# EAGLE design beaconboard3 (EAGLE 6.6.0)
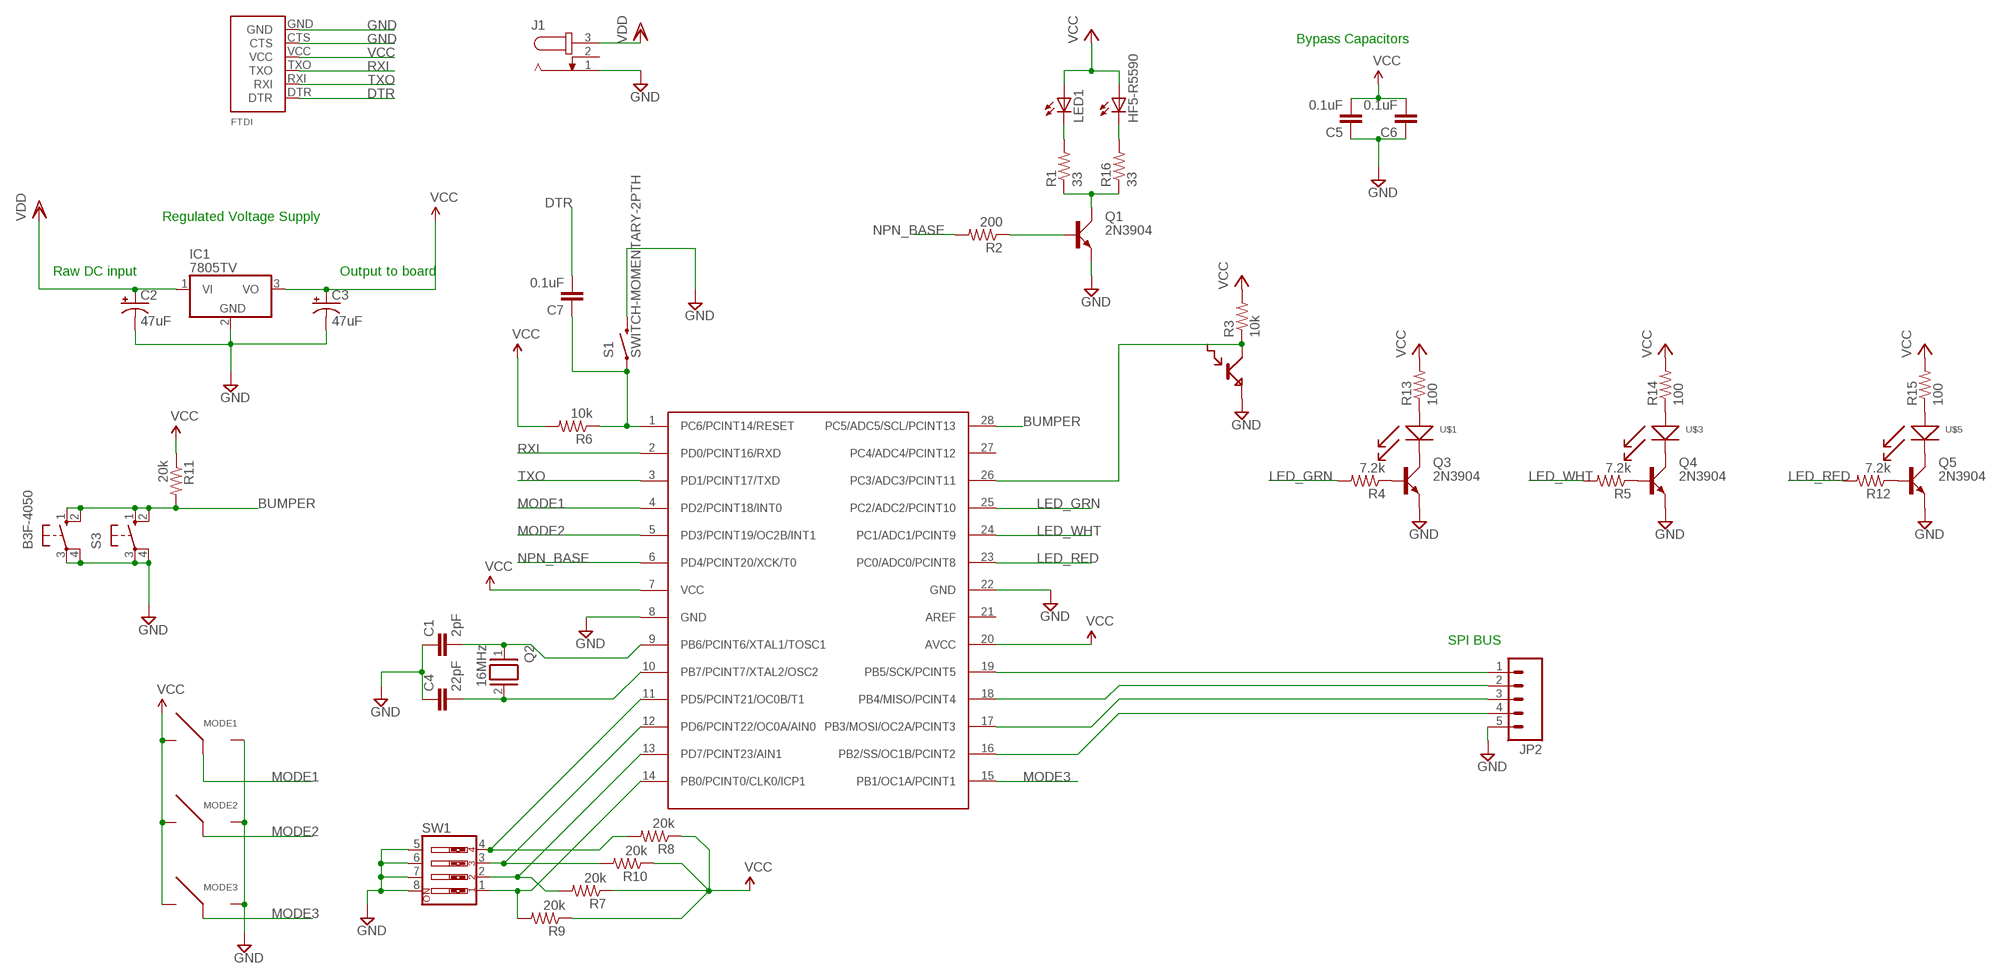
[diagram p0: schematic, sheet 1]

## Parts
B3F-4050  40-XX  [B3F-40XX]
C1  2pF  CAPPTH  [CAP-PTH-SMALL]
C2  47uF  CAP_POLPTH2  [CPOL-RADIAL-10UF-25V]
C3  47uF  CAP_POLPTH2  [CPOL-RADIAL-10UF-25V]
C4  22pF  CAPPTH  [CAP-PTH-SMALL]
C5  0.1uF  CAPPTH1  [CAP-PTH-5MM]
C6  0.1uF  CAPPTH1  [CAP-PTH-5MM]
C7  0.1uF  CAPPTH1  [CAP-PTH-5MM]
HF5-R5590  LED-2AC-CP41B-WES  [CP41B]
IC1  7805TV  [TO220V]
J1  JACK-PLUG1  [SPC4078]
JP2  M05LOCK_LONGPADS  [1X05_LOCK_LONGPADS]
LED1  LED-2AC-CP41B-WES  [CP41B]
MODE1  SPD_SLIDE_SWITCH  [SPDT_SLIDE_SWITCH]
MODE2  SPD_SLIDE_SWITCH  [SPDT_SLIDE_SWITCH]
MODE3  SPD_SLIDE_SWITCH  [SPDT_SLIDE_SWITCH]
Q1  2N3904  [TO92D]
Q2  16MHz  XTAL/S  [QS]
Q3  2N3904  [TO92D]
Q4  2N3904  [TO92D]
Q5  2N3904  [TO92D]
R1  33  RESISTORPTH-1/4W  [AXIAL-0.4]
R2  200  RESISTORPTH-1/4W  [AXIAL-0.4]
R3  10k  RESISTORPTH-1/4W  [AXIAL-0.4]
R4  7.2k  RESISTORPTH-1/4W  [AXIAL-0.4]
R5  7.2k  RESISTORPTH-1/4W  [AXIAL-0.4]
R6  10k  RESISTORPTH-1/4W  [AXIAL-0.4]
R7  20k  RESISTORPTH-1/4W  [AXIAL-0.4]
R8  20k  RESISTORPTH-1/4W  [AXIAL-0.4]
R9  20k  RESISTORPTH-1/4W  [AXIAL-0.4]
R10  20k  RESISTORPTH-1/4W  [AXIAL-0.4]
R11  20k  RESISTORPTH-1/4W  [AXIAL-0.4]
R12  7.2k  RESISTORPTH-1/4W  [AXIAL-0.4]
R13  100  RESISTORPTH-1/4W  [AXIAL-0.4]
R14  100  RESISTORPTH-1/4W  [AXIAL-0.4]
R15  100  RESISTORPTH-1/4W  [AXIAL-0.4]
R16  33  RESISTORPTH-1/4W  [AXIAL-0.4]
S1  SWITCH-MOMENTARY-2PTH  [TACTILE-PTH]
S3  40-XX  [B3F-40XX]
SW1  SW_DIP-4  [EDG-04]
U$1  8MM_LED  [8MM_LED]
U$2  BPW77NA  [TO-18]
U$3  8MM_LED  [8MM_LED]
U$4  ATMEGA328  [DIL28-3]
U$5  8MM_LED  [8MM_LED]
U$6  FTDI  [FTDI]

## Nets
BUMPER: B3F-4050.1(S) B3F-4050.2(S1) R11.P$2 S3.1(S) S3.2(S1) U$4.28(PC5/ADC5/SCL/PCINT13)
DTR: C7.2 U$6.DTR
GND: B3F-4050.3(P) B3F-4050.4(P1) C1.1 C2.2(-) C3.2(-) C4.1 C5.1 C6.1 IC1.2(GND) J1.1 JP2.5 MODE1.3 MODE2.3 MODE3.3 Q1.E Q3.E Q4.E Q5.E S1.3 S3.3(P) S3.4(P1) SW1.5 SW1.6 SW1.7 SW1.8 U$2.E U$4.8(GND) U$4.22(GND) U$6.CTS U$6.GND
LED_GRN: R4.P$2 U$4.25(PC2/ADC2/PCINT10)
LED_RED: R12.P$2 U$4.23(PC0/ADC0/PCINT8)
LED_WHT: R5.P$2 U$4.24(PC1/ADC1/PCINT9)
MODE1: MODE1.2 U$4.4(PD2/PCINT18/INT0)
MODE2: MODE2.2 U$4.5(PD3/PCINT19/OC2B/INT1)
MODE3: MODE3.2 U$4.15(PB1/OC1A/PCINT1)
N$1: Q1.C R1.P$1 R16.P$1
N$2: Q1.B R2.P$1
N$3: LED1.1(C) LED1.4(C) R1.P$2
N$4: Q3.B R4.P$1
N$5: JP2.1 U$4.19(PB5/SCK/PCINT5)
N$6: JP2.2 U$4.18(PB4/MISO/PCINT4)
N$7: JP2.3 U$4.17(PB3/MOSI/OC2A/PCINT3)
N$8: Q4.B R5.P$1
N$9: R3.P$1 U$2.C U$4.26(PC3/ADC3/PCINT11)
N$10: Q5.B R12.P$1
N$11: C7.1 R6.P$1 S1.1 U$4.1(PC6/PCINT14/RESET)
N$12: C1.2 Q2.1 U$4.9(PB6/PCINT6/XTAL1/TOSC1)
N$13: C4.2 Q2.2 U$4.10(PB7/PCINT7/XTAL2/OSC2)
N$14: R7.P$2 SW1.2 U$4.13(PD7/PCINT23/AIN1)
N$15: R8.P$2 SW1.4 U$4.11(PD5/PCINT21/OC0B/T1)
N$16: R10.P$2 SW1.3 U$4.12(PD6/PCINT22/OC0A/AIN0)
N$17: Q3.C U$1.NEG
N$18: Q4.C U$3.NEG
N$19: R9.P$2 SW1.1 U$4.14(PB0/PCINT0/CLK0/ICP1)
N$20: JP2.4 U$4.16(PB2/SS/OC1B/PCINT2)
N$21: Q5.C U$5.NEG
N$22: R13.P$1 U$1.POS
N$23: R14.P$1 U$3.POS
N$24: R15.P$1 U$5.POS
N$25: HF5-R5590.1(C) HF5-R5590.4(C) R16.P$2
NPN_BASE: R2.P$2 U$4.6(PD4/PCINT20/XCK/T0)
RXI: U$4.2(PD0/PCINT16/RXD) U$6.TXO
TXO: U$4.3(PD1/PCINT17/TXD) U$6.RXI
VCC: C3.1(+) C5.2 C6.2 HF5-R5590.2(A) HF5-R5590.3(A) IC1.3(VO) LED1.2(A) LED1.3(A) MODE1.1 MODE2.1 MODE3.1 R3.P$2 R6.P$2 R7.P$1 R8.P$1 R9.P$1 R10.P$1 R11.P$1 R13.P$2 R14.P$2 R15.P$2 U$4.7(VCC) U$4.20(AVCC) U$6.VCC
VDD: C2.1(+) IC1.1(VI) J1.3
Unconnected: J1.2 U$4.21(AREF) U$4.27(PC4/ADC4/PCINT12)

## Notes on the sheet
- Bypass Capacitors
- Regulated Voltage Supply
- Raw DC input | Output to board
- SPI BUS

## Library data of the parts
B3F-4050 S3 = switch-omron:40-XX: OMRON SWITCH; MF: OMRON COMPONENTS USA; MPN: B3F-4000; OC_FARNELL: 176434; OC_NEWARK: 36K3105
C1 C4-C7 = SparkFun-Passives:CAP: Capacitor Standard 0603 ceramic capacitor, and 0.1" leaded capacitor.
C2 C3 = SparkFun-Capacitors:CAP_POL: Capacitor Polarized These are standard SMD and PTH capacitors. Normally 10uF, 47uF, and 100uF in electrolytic and tantalum varieties. Always verify the external diameter of the through hole cap, it varies with capacity, voltage, and manufacturer. The EIA devices should be standard.
HF5-R5590 LED1 = led:LED-2AC-: LEDs with 2 Cathode & 2 Anode - Kingbright SUPER FLUX LED LAMP Source: www.us.kingbright.com/images/catalog/SPEC/W7676CPBC-H.pdf Cree® P4 LED CP41B-WES/WGS Source: Data sheet <http://www.cree.com/products/pdf/LEDlamps/CP41B-WES&WGS.pdf>
IC1 = linear:78*: Positive VOLTAGE REGULATOR Source: http://cache.national.com/ds/LM/LM78L05.pdf http://www.fairchildsemi.com/ds/LM/LM7805.pdf
J1 = con-jack:JACK-PLUG: DC POWER JACK Power Jack, DC, Right Angle, Through Hole, Rated 5A at 16VDC, PC Terminals Distributor: Farnell (www.Farnell.de) Drawing: 84N1161.pdf / 84N1162.pdf Manufacturer: SPC Technology (www.spctechnology.com) Type: SPC4077 / SPC 4078; OC_FARNELL: unknown; OC_NEWARK: unknown
JP2 = SparkFun-Connectors:M05: Header 5 Standard 5-pin 0.1" header. Use with straight break away headers (SKU : PRT-00116), right angle break away headers (PRT-00553), swiss pins (PRT-00743), machine pins (PRT-00117), and female headers (PRT-00115). Molex polarized connector foot print use with SKU : PRT-08230 with associated crimp pins and housings.
MODE1-MODE3 = e11:SPD_SLIDE_SWITCH
Q1 Q3-Q5 = transistor-small-signal:2N3904: NPN TRANSISTOR
Q2 = special:XTAL/S: CRYSTAL
R1-R16 = SparkFun-Resistors:RESISTOR: Resistor Basic schematic elements and footprints for 0603, 1206, and PTH resistors.
S1 = SparkFun-Electromechanical:SWITCH-MOMENTARY-2: Various NO switches- pushbuttons, reed, etc
SW1 = special:SW_DIP-4: DIP SWITCH
U$1 U$3 U$5 = e11:8MM_LED
U$2 = e11:BPW77NA
U$4 = hmcfabstudio:ATMEGA328: Atmega328 in a DIL28 package with pin names taken from the datasheet.
U$6 = e11:FTDI

## Board
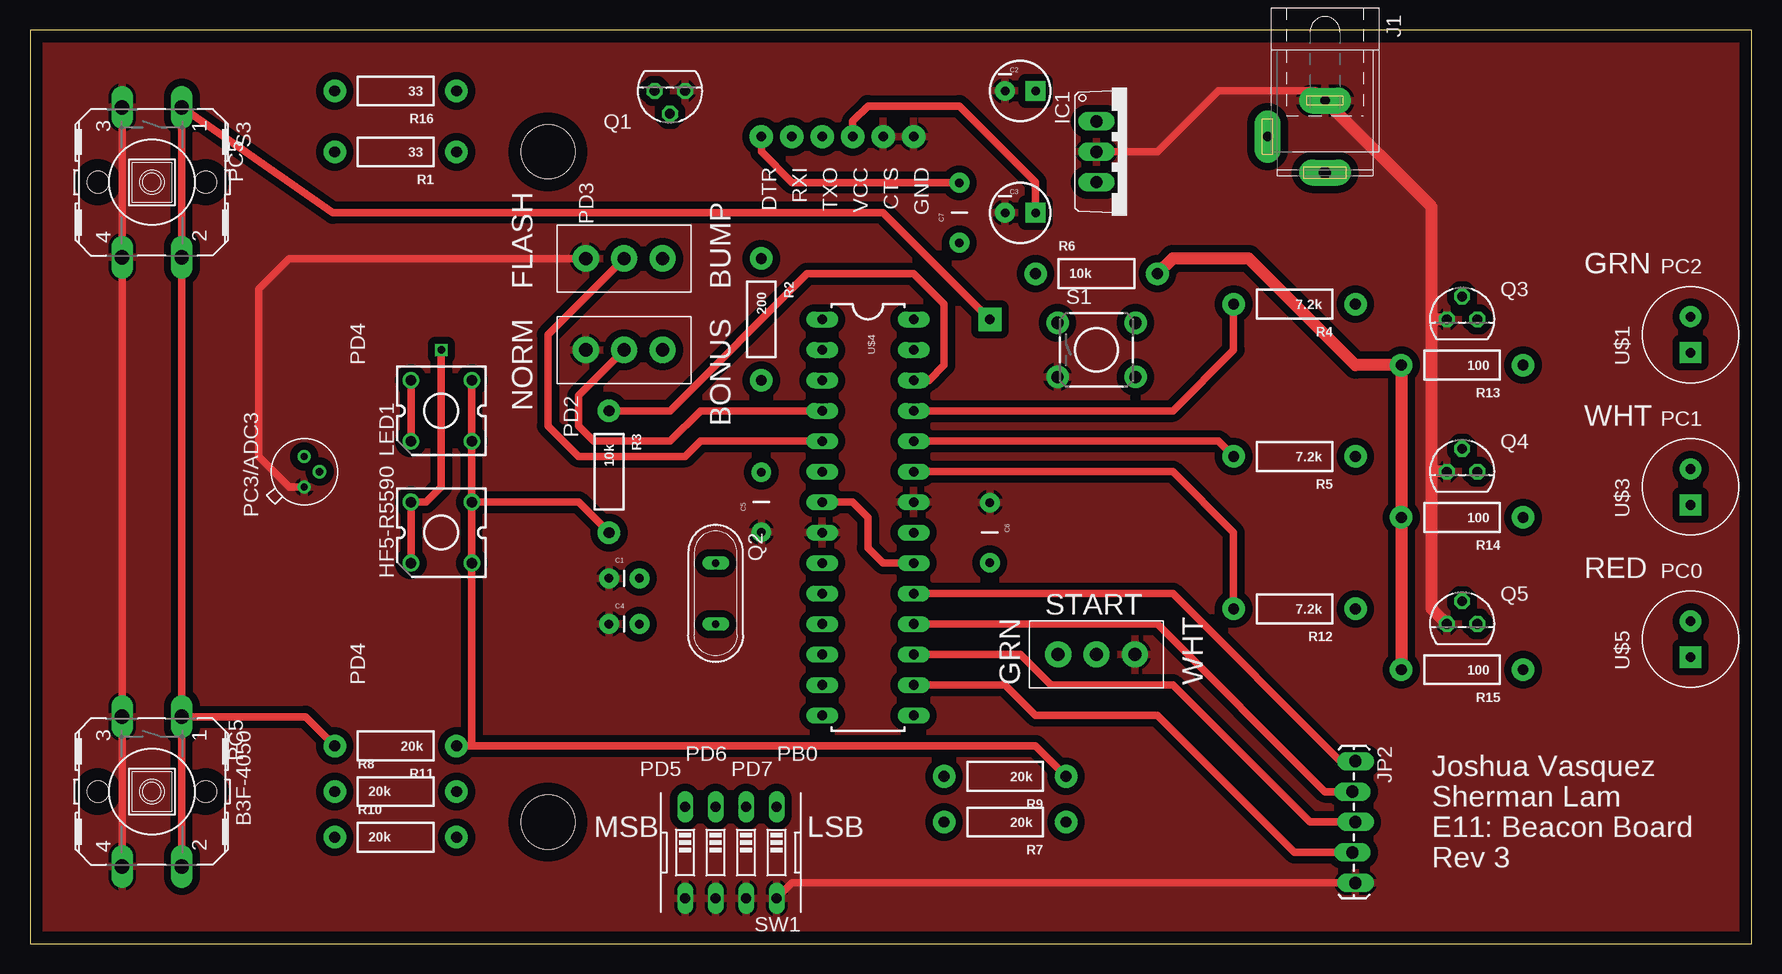
[diagram p1: board, top side]
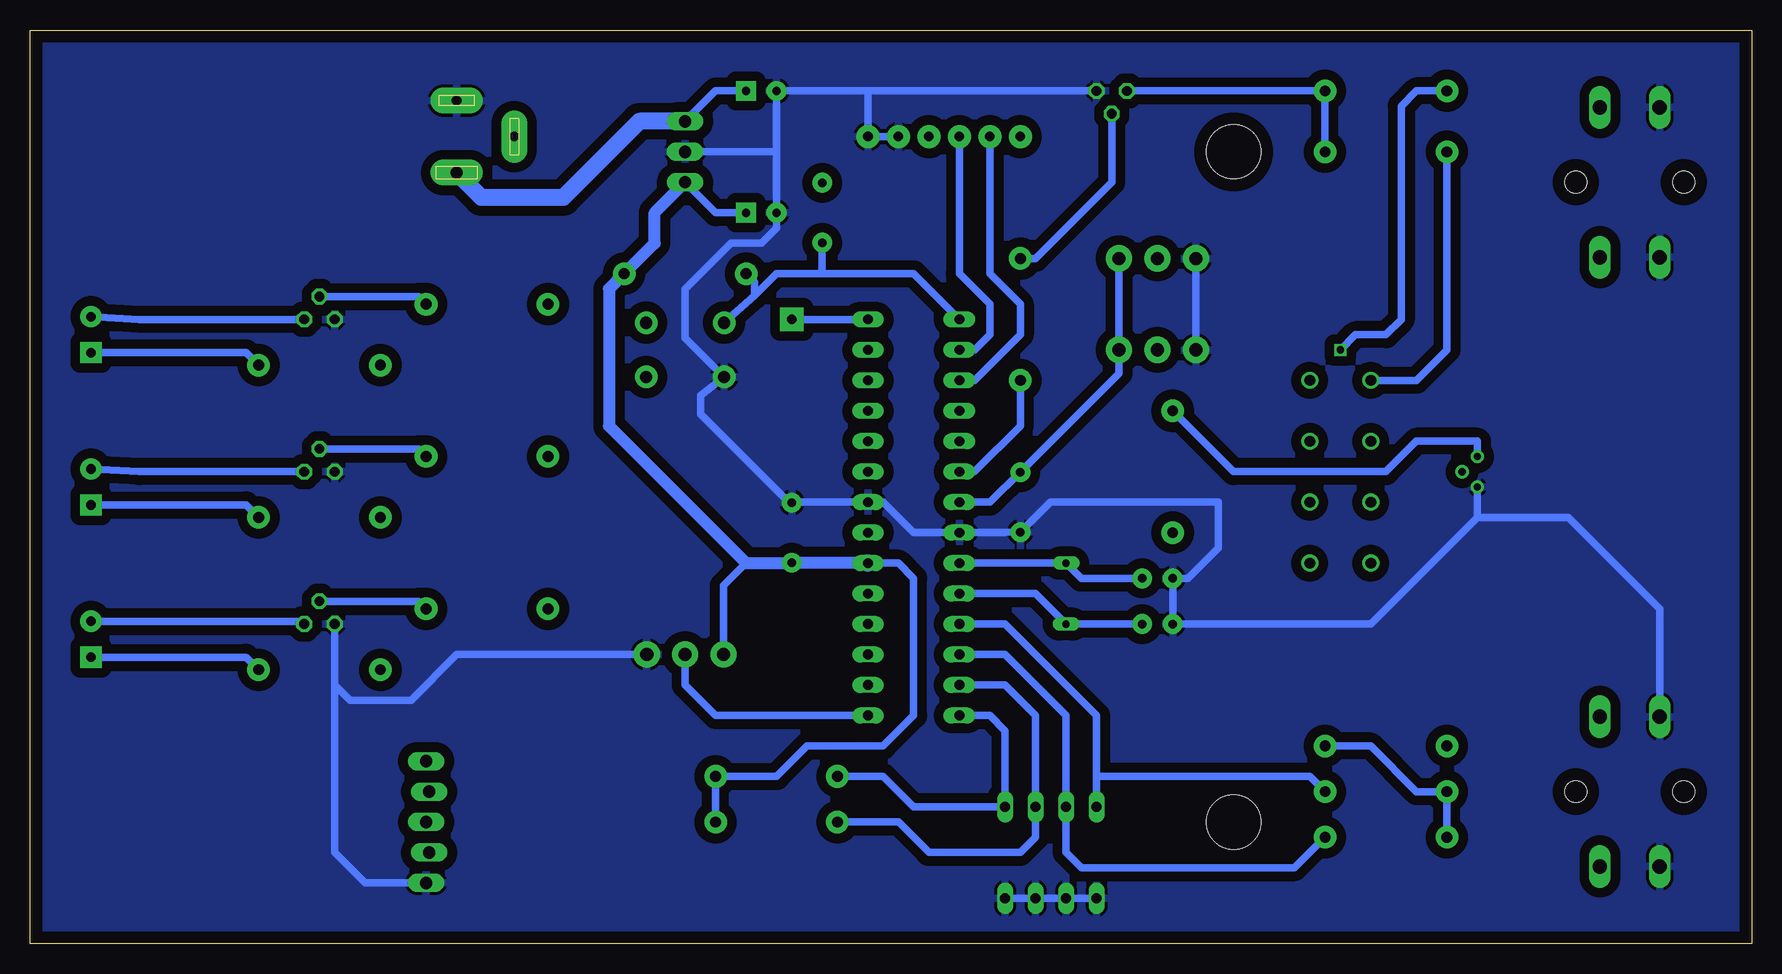
[diagram p2: board, bottom side, seen from below]

Size 143.51 x 76.2 mm. Coordinates in mm from the lower left corner, seen from the top.
Outline: 0,0 143.51,0 143.51,76.2 0,76.2 0,0
Copper layers (1*16): Top 0.035mm / dielectric 1.5mm / Bottom 0.035mm
Design rules "default": minimum track width 10mil, minimum drill 24mil, track to track 8mil, track to pad 8mil, pad to pad 8mil, via to via 8mil, smd to smd 8mil, copper to edge 40mil, drill to drill 8mil, minimum pad ring 10mil, minimum via ring 8mil, stop-mask expansion 4mil, vias tented up to drill 0mil, thermal gap 10mil
Holes 4.5 mm at 43.18,10.16 43.18,66.04

### Footprints (pad centres in the part's own frame; a part is rotated, then mirrored left to right if it is on the bottom)
B3F-40XX = drill 1.194 long: 1 -6.248,2.489; 2 6.248,2.489; 3 -6.248,-2.489; 4 6.248,-2.489 | hole 1.803: 0,-4.496; 0,4.496
CAP-PTH-SMALL = drill 0.7 pad 1.651: 1 0,0; 2 2.54,0
CPOL-RADIAL-10UF-25V = drill 0.7 pad 1.651 square: 1 1.27,0 | drill 0.7 pad 1.651: 2 -1.27,0
CAP-PTH-5MM = drill 0.7 pad 1.651: 1 -2.5,0; 2 2.5,0
CP41B = drill 0.9 pad 1.27: 1 -2.54,2.54; 2 -2.54,-2.54; 3 2.54,-2.54; 4 2.54,2.54
TO220V = drill 1.016 long: 1 -2.54,-2.54; 2 0,-2.54; 3 2.54,-2.54
SPC4078 = drill 0.8 pad 2.184 long: 1 -3,0; 2 0,-4.8 | drill 1 pad 2.184 long: 3 3,0
1X05_LOCK_LONGPADS = drill 1.016 long: 1 0,0; 2 2.54,-0.254; 3 5.08,0; 4 7.62,-0.254; 5 10.16,0
SPDT_SLIDE_SWITCH = drill 1.1 pad 2.184: 1 -3.2,0; 2 0,0; 3 3.2,0
TO92D = drill 0.813 octagon: B 0,1.905; C 1.27,0; E -1.27,0
QS = drill 0.61 long: 1 -2.54,0; 2 2.54,0
AXIAL-0.4 = drill 0.9 pad 1.88: P$1 -5.08,0; P$2 5.08,0
TACTILE-PTH = drill 1.016 pad 1.88: 1 -3.251,2.261; 2 3.251,2.261; 3 -3.251,-2.261; 4 3.251,-2.261
EDG-04 = drill 0.813 long: 1 -3.81,-3.81; 2 -1.27,-3.81; 3 1.27,-3.81; 4 3.81,-3.81; 5 3.81,3.81; 6 1.27,3.81; 7 -1.27,3.81; 8 -3.81,3.81
8MM_LED = drill 0.8 pad 1.778: NEG 1.5,0 | drill 0.8 pad 1.778 square: POS -1.5,0
TO-18 = drill 0.6: B 0,-1.27; C 1.27,0; E -1.27,0
DIL28-3 = drill 0.813 long: 1 -16.51,-3.81; 2 -13.97,-3.81; 3 -11.43,-3.81; 4 -8.89,-3.81; 5 -6.35,-3.81; 6 -3.81,-3.81; 7 -1.27,-3.81; 8 1.27,-3.81; 9 3.81,-3.81; 10 6.35,-3.81; 11 8.89,-3.81; 12 11.43,-3.81; 13 13.97,-3.81; 14 16.51,-3.81; 15 16.51,3.81; 16 13.97,3.81; 17 11.43,3.81; 18 8.89,3.81; 19 6.35,3.81; 20 3.81,3.81; 21 1.27,3.81; 22 -1.27,3.81; 23 -3.81,3.81; 24 -6.35,3.81; 25 -8.89,3.81; 26 -11.43,3.81; 27 -13.97,3.81; 28 -16.51,3.81
FTDI = drill 0.8 pad 1.93: CTS 1.27,5.08; DTR 1.27,-5.08; GND 1.27,7.62; RXI 1.27,-2.54; TXO 1.27,0; VCC 1.27,2.54

### Placement (x,y rotation side)
B3F-4050  10.16,12.7 270 top
C1  48.26,30.48 0 top
C2  82.55,71.12 0 top
C3  82.55,60.96 0 top
C4  48.26,26.67 0 top
C5  60.96,36.83 90 top
C6  80.01,34.29 270 top
C7  77.47,60.96 90 top
HF5-R5590  34.29,34.29 90 top
IC1  91.44,66.04 270 top
J1  107.95,67.31 270 top
JP2  110.49,15.24 270 top
LED1  34.29,44.45 90 top
MODE1  49.53,49.53 180 top
MODE2  49.53,57.15 180 top
MODE3  88.9,24.13 0 top
Q1  53.34,71.12 180 top
Q2  57.15,29.21 270 top
Q3  119.38,52.07 0 top
Q4  119.38,39.37 0 top
Q5  119.38,26.67 0 top
R1  30.48,66.04 180 top
R2  60.96,52.07 270 top
R3  48.26,39.37 270 top
R4  105.41,53.34 180 top
R5  105.41,40.64 180 top
R6  88.9,55.88 0 top
R7  81.28,10.16 180 top
R8  30.48,12.7 0 top
R9  81.28,13.97 180 top
R10  30.48,8.89 0 top
R11  30.48,16.51 180 top
R12  105.41,27.94 180 top
R13  119.38,48.26 180 top
R14  119.38,35.56 180 top
R15  119.38,22.86 180 top
R16  30.48,71.12 180 top
S1  88.9,49.53 0 top
S3  10.16,63.5 270 top
SW1  58.42,7.62 180 top
U$1  138.43,50.8 90 top
U$2  22.86,39.37 90 top
U$3  138.43,38.1 90 top
U$4  69.85,35.56 270 top
U$5  138.43,25.4 90 top
U$6  66.04,68.58 270 top

### Tracks (layer width: path | path; a pad name or v marks a point on that pad's centre or on a via)
BUMPER  (via drill 0.8 pad 1.93)
  Top 0.61: v80.01,52.07 71.12,60.96 25.25,60.96 S3.1 S3.2 B3F-4050.1 | B3F-4050.1 22.96,18.95 R11.P$2 | B3F-4050.2 B3F-4050.1
  Bottom 0.61: U$4.28 v80.01,52.07
DTR
  Top 0.61: C7.2 63.54,63.46 60.96,66.04 U$6.DTR
GND
  Top 0.61: IC1.2 93.98,66.04 99.06,71.12 107.14,71.12 J1.1 | JP2.5 63.5,5.08 SW1.8 | S3.3 S3.4 B3F-4050.3 B3F-4050.4 | MODE2.3 21.59,57.15 19.05,54.61 19.05,40.64 21.59,38.1 U$2.E
  Top 1.016: Q5.E 116.84,27.94 116.84,39.37 | 116.84,39.37 116.84,52.07 | 116.84,52.07 116.84,61.42 J1.1 | Q4.E 116.84,39.37 | Q3.E 116.84,52.07
  Bottom 0.61: 80.01,36.83 U$4.22 72.39,36.83 69.85,34.29 U$4.8 62.23,34.29 C5.1 58.46,36.83 44.45,36.83 44.45,33.02 46.99,30.48 C1.1 C4.1 31.75,26.67 22.86,35.56 | SW1.8 SW1.7 SW1.6 SW1.5 | C6.1 80.01,36.83 | 80.01,36.83 80.29,36.83 87.63,44.17 87.63,45.72 S1.3 88.9,50.52 88.9,54.61 85.09,58.42 82.55,58.42 81.28,59.69 C3.2 81.28,66.04 | 81.28,66.04 IC1.2 | 81.28,66.04 C2.2 73.66,71.12 | Q1.E 73.66,71.12 | 73.66,71.12 U$6.GND U$6.CTS | MODE3.3 107.95,24.13 111.76,20.32 116.84,20.32 118.11,21.59 | 118.11,21.59 Q5.E | U$2.E 22.86,35.56 | 22.86,35.56 15.29,35.56 7.67,27.94 B3F-4050.3 | MODE1.3 46.33,56.54 45.72,57.15 MODE2.3 | JP2.5 115.57,5.08 118.11,7.62 118.11,21.59
  pour Bottom (isolate 0.813): 0,76.2 144.78,76.2 144.78,0 0,0
  pour Top (isolate 0.61): 0,76.2 0,0 146.05,0 146.05,76.2
LED_GRN
  Top 0.61: U$4.25 95.25,44.45 100.33,49.53 R4.P$2
LED_RED
  Top 0.61: U$4.23 95.25,39.37 100.33,34.29 R12.P$2
LED_WHT
  Top 0.61: U$4.24 99.06,41.91 R5.P$2
MODE1
  Top 0.61: MODE1.2 45.72,45.72 45.72,43.18 46.99,41.91 53.34,41.91 55.88,44.45 U$4.4
MODE2
  Top 0.61: MODE2.2 43.18,50.8 43.18,43.18 45.72,40.64 54.61,40.64 55.88,41.91 U$4.5
MODE3
  Bottom 0.61: MODE3.2 88.9,21.59 86.36,19.05 U$4.15
N$1
  Bottom 0.61: R1.P$1 R16.P$1 Q1.C
N$2
  Bottom 0.61: R2.P$1 59.69,57.15 53.34,63.5 Q1.B
N$3
  Top 0.61: LED1.1 LED1.4
  Bottom 0.61: R1.P$2 25.4,49.53 27.94,46.99 LED1.4
N$4
  Bottom 0.61: Q3.B 111.12,53.98 R4.P$1
N$5
  Top 0.61: U$4.19 95.25,29.21 109.22,15.24 JP2.1
N$6
  Top 0.61: U$4.18 93.98,26.67 107.95,12.7 JP2.2
N$7
  Top 0.61: U$4.17 82.55,24.13 85.09,21.59 95.25,21.59 106.68,10.16 JP2.3
N$8
  Bottom 0.61: Q4.B 111.12,41.27 R5.P$1
N$9
  Top 0.61: U$4.26 74.93,46.99 76.2,48.26 76.2,53.34 73.66,55.88 64.77,55.88 53.34,44.45 R3.P$1
  Bottom 0.61: U$2.C 22.86,41.91 27.94,41.91 30.48,39.37 43.18,39.37 R3.P$1
N$10
  Bottom 0.61: Q5.B 111.12,28.57 R12.P$1
N$11
  Bottom 0.61: R6.P$1 83.11,55.17 83.11,54.05 | S1.1 83.11,54.05 | 83.11,54.05 81.28,55.88 77.47,55.88 | 77.47,55.88 69.85,55.88 U$4.1 | C7.1 77.47,55.88
N$12
  Bottom 0.61: U$4.9 Q2.1 55.88,30.48 C1.2
N$13
  Bottom 0.61: U$4.10 59.69,29.21 Q2.2 C4.2
N$14
  Bottom 0.61: U$4.13 62.23,21.59 59.69,19.05 SW1.2 59.69,8.89 60.96,7.62 68.58,7.62 71.12,10.16 R7.P$2
N$15
  Bottom 0.61: U$4.11 62.23,26.67 54.61,19.05 54.61,13.97 | 54.61,13.97 SW1.4 | R8.P$2 36.83,13.97 54.61,13.97
N$16
  Bottom 0.61: U$4.12 62.23,24.13 57.15,19.05 SW1.3 57.15,7.62 55.88,6.35 38.1,6.35 R10.P$2
N$17
  Bottom 0.61: Q3.C 134.39,52.07 U$1.NEG
N$18
  Bottom 0.61: Q4.C 134.39,39.37 U$3.NEG
N$19
  Bottom 0.61: U$4.14 63.5,19.05 62.23,17.78 SW1.1 69.85,11.43 72.39,13.97 R9.P$2
N$20
  Top 0.61: U$4.16 81.28,21.59 83.82,19.05 93.98,19.05 105.41,7.62 JP2.4
N$21
  Bottom 0.61: U$5.NEG 120.88,26.9 Q5.C
N$22
  Bottom 0.61: U$1.POS 125.5,49.3 R13.P$1
N$23
  Bottom 0.61: U$3.POS 125.5,36.6 R14.P$1
N$24
  Bottom 0.61: U$5.POS 125.5,23.9 R15.P$1
N$25  (via drill 0.6)
  Top 0.61: v34.29,49.53 34.29,38.1 33.02,36.83 HF5-R5590.4 HF5-R5590.1
  Bottom 0.61: R16.P$2 27.94,71.12 29.21,69.85 29.21,52.07 30.48,50.8 33.02,50.8 v34.29,49.53
NPN_BASE
  Bottom 0.61: U$4.6 64.77,39.37 60.96,43.18 R2.P$2
RXI
  Bottom 0.61: U$6.TXO 66.04,55.88 63.5,53.34 63.5,50.8 64.77,49.53 U$4.2
TXO
  Bottom 0.61: U$6.RXI 63.5,55.88 60.96,53.34 60.96,50.8 64.77,46.99 U$4.3
VCC
  Top 0.61: R11.P$1 36.83,16.51 | 36.83,16.51 83.82,16.51 R9.P$1 | U$4.7 68.58,36.83 69.85,35.56 69.85,33.02 71.12,31.75 U$4.20 | U$6.VCC 68.58,68.58 69.85,69.85 77.47,69.85 83.82,63.5 C3.1 | HF5-R5590.3 LED1.2 LED1.3 | HF5-R5590.3 45.72,36.83 R3.P$2 | 36.83,16.51 HF5-R5590.2 HF5-R5590.3
  Top 1.016: R15.P$2 R14.P$2 R13.P$2 110.49,48.26 101.6,57.15 95.25,57.15 R6.P$2
  Bottom 0.61: C3.1 86.36,60.96 IC1.3 | U$4.7 63.5,36.83 C5.2 52.73,47.56 MODE1.1 MODE2.1 | U$4.20 71.12,31.75 69.85,30.48 69.85,19.05 72.39,16.51 78.74,16.51 81.28,13.97 R9.P$1 R7.P$1 | R10.P$1 R8.P$1 27.94,12.7 31.75,16.51 R11.P$1 | MODE3.1 85.7,29.87 83.82,31.75
  Bottom 1.016: IC1.3 91.44,60.96 91.44,58.42 R6.P$2 95.25,54.61 95.25,43.18 83.82,31.75 80.05,31.75 | C6.2 73.7,31.79
  Bottom 1.422: 80.05,31.75 C6.2 | 73.7,31.79 U$4.20
VDD
  Bottom 0.61: IC1.1 86.36,71.12 C2.1
  Bottom 1.422: IC1.1 92.71,68.58 99.06,62.23 105.87,62.23 J1.3

### Text on the board
tPlace: PC5 | PD3 | GRN | PC2 | FLASH | BUMP | PD4 | PD2 | NORM | BONUS | WHT | PC1 | PC3/ADC3 | PC0 | PD4 | PC5 | PD6 | PB0 | PD5 | PD7
tNames: RED | START | GRN | WHT | Joshua Vasquez | Sherman Lam | MSB | LSB | E11: Beacon Board | Rev 3